# Altium schematic sheet CAN_Module.SchDoc
size 279 x 199 mm
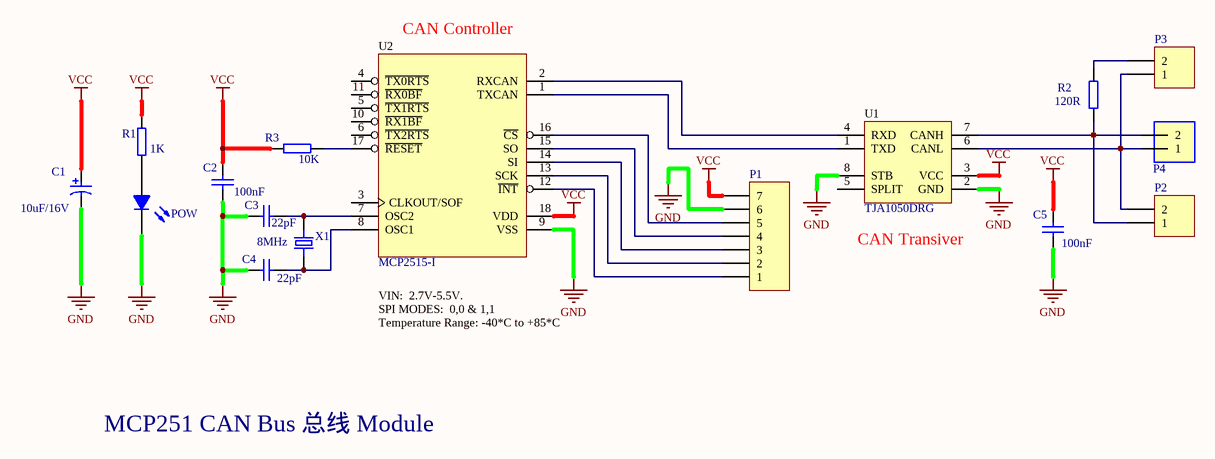
[diagram p0: CAN_Module.SchDoc]

## Parts
C1  10uF/16V  [tantalum  A]  (value not drawn)
C2  100nF  [C0603]  (value not drawn)
C3  22pF  [C0603]  (value not drawn)
C4  22pF  [C0603]  (value not drawn)
C5  100nF  [C0603]  (value not drawn)
P1  Header 7  [HDR1X7]  (value not drawn)
P2  Header 2  [HDR1X2]  (value not drawn)
P3  Header 2  [HDR1X2]  (value not drawn)
P4  Terminal Block 3.5mmPitch: 3,5 mmNumber of pins: 2Created by Rembrandt Electronicswww.rembrandtelectronics.com  [TERMINAL-BLOCK-2-PIN-3.5MM-ROUND-PAD]  (value not drawn)
POW  RED LED  [CHIPLED_0603]  (value not drawn)
R1  1kΩ  [R0603]  (value not drawn)
R2  120Ω  [R0603]  (value not drawn)
R3  10kΩ  [R0603]  (value not drawn)
U1  TJA1050DRG  [SOIC-8E]
U2  MCP2515-I  [SOIC-18_L11.6-W7.5-P1.27-LS10.3-BL]
X1  8MHz  [HC-49US_L11.5-W4.5-P4.88]  (value not drawn)

## Nets
GND: C1.2 C2.1 C3.2 C4.2 C5.1 P1.6 POW.C(K) U1.2(GND) U1.8(STB) U2.9(VSS)
VCC: C1.1 C2.2 C5.2 P1.7 R1.1 R3.2 U1.3(VCC) U2.18(VDD)
NetC3_1: C3.1 U2.7(OSC2) X1.2
NetC4_1: C4.1 U2.8(OSC1) X1.1
NetP1_1: P1.1 U2.12(~{INT})
NetP1_2: P1.2 U2.13(SCK)
NetP1_3: P1.3 U2.14(SI)
NetP1_4: P1.4 U2.15(SO)
NetP1_5: P1.5 U2.16(~{CS})
NetP2_1: P2.1 P4.2 R2.1 U1.7(CANH)
NetP2_2: P2.2 P3.1 P4.1 U1.6(CANL)
NetP3_2: P3.2 R2.2
NetPOW_A: POW.A R1.2
NetR3_1: R3.1 U2.17(~{RESET})
NetU1_1: U1.1(TXD) U2.1(TXCAN)
NetU1_4: U1.4(RXD) U2.2(RXCAN)

Not connected (* = marked no-connect by the designer): U1 5(SPLIT); U2 3(CLKOUT/SOF) 4(~{TX0RTS}) 5(~{TX1RTS}) 6(~{TX2RTS}) 10(~{RX1BF}) 11(~{RX0BF})

## Notes on the sheet
- (near U2) CAN Controller
- (near R2) 120R
- (near R1) 1K
- 100nF
- (near R3) 10K
- (near C1) 10uF/16V
- 8MHz
- (near C3) 22pF
- (near U1) CAN Transiver
- (near C5) 100nF
- (near C4) 22pF
- SPI MODES:  0,0 & 1,1
- Temperature Range: -40*C to +85*C
- VIN:  2.7V-5.5V.
- MCP251 CAN Bus 总线 Module

## Library data of the parts
C1 = Cap_Tantalum: SMD Tantalum Capacitor
C2-C5 = Cap_0603: Capacitor, X5R, ±10%, 6.3V; Part Number: C0603-N.C.; Manufacturer: N.A.; Artikkelnr Noca: 20069060; Datasheet: *; LatestRevisionDate: 2009-11-23; Pin Count: 2; Publisher: Nordic Semiconductor; Published: 2009-05-08; Volts: 6.3V; Supplier: *; Supplier part number: *; 2nd source Supplier: *; 2nd source part number: *; Footprint Doc: 0603; Artikkelnr Simpro: N.A.; Manufacturer Part Number: N.A.
  C2 C5: Value: 100nF
  C3 C4: Value: 22pF
P1 = Header 7: Header, 7-Pin; LatestRevisionDate: 17-Jul-2002; LatestRevisionNote: Re-released for DXP Platform.; Publisher: Altium Limited
P2 P3 = Header 2: Header, 2-Pin; LatestRevisionDate: 17-Jul-2002; LatestRevisionNote: Re-released for DXP Platform.; Publisher: Altium Limited
P4 = TERMINAL-3.50-2P: Screw Terminal 3.5mm; SymbolName_1: TERMINAL-BLOCK-PIN-3.5MM; GateName_1: -1
POW = LEDCHIP-LED0603: SMD lamp beads
R1-R3 = Res_0603: Resistor, ±1%, 0.100W; Part Number: R0603-N.C.Ω; Manufacturer: N.A.; Note: Chip Res; Manufacturer Part Number: N.A.; Datasheet: *; Footprint Doc: 0603; LatestRevisionDate: 2009-05-08; Pin Count: 2; Publisher: Nordic Semiconductor; Published: 2009-05-08; Supplier: *; Supplier part number: *; 2nd source Supplier: *; 2nd source part number: *; Artikkelnr Noca: N.A.; Artikkelnr Simpro: N.A.
  R1: Value: 1kΩ
  R2: Value: 120Ω
  R3: Value: 10kΩ
U1 = TJA1050DRG: CAN Transiver; Manufacturer: HGC(深圳汉芯); Add into BOM: yes; Symbol: TJA1050DRG; Device: TJA1050DRG; LCSC Part Name: TJA1050DRG; Supplier Part: C19723770; Manufacturer Part: TJA1050DRG; Supplier Footprint: SOP-8; JLCPCB Part Class: Extended Part; Datasheet: https://atta.szlcsc.com/upload/public/pdf/source/20231229/9EC40A6172CAB0350BF7AF3421F4DEBF.pdf; Supplier: LCSC; Convert to PCB: yes
U2 = MCP2515: CAN Controller; Manufacturer: Tokmas(托克马斯); Add into BOM: yes; Symbol: MCP2515-I; Device: MCP2515-I; Supplier: LCSC; Supplier Part: C5250735; Manufacturer Part: MCP2515-I; JLCPCB Part Class: Extended Part; LCSC Part Name: CAN芯片; Supplier Footprint: TSSOP-20; Datasheet: https://atta.szlcsc.com/upload/public/pdf/source/20221108/54102364C5045B746FF767DA10992A5D.pdf; Convert to PCB: yes
X1 = CRYSTAL-ECS-100-20-5PVX: 10MHz Â±30ppm Crystal 20pF 60 Ohms HC-49/US; MF: ECS Inc.; Availability: Warning; SnapEDA_Link: https://www.snapeda.com/parts/ECS-100-20-5PVX/ECS%20Inc./view-part/2721546/?ref=snap; MP: ECS-100-20-5PVX; Value: 8MHz; Price: None; Package: HC49/US ECS International; Check_prices: https://www.snapeda.com/parts/ECS-100-20-5PVX/ECS%20Inc./view-part/2721546/?ref=eda